# Altium schematic sheet SPI_UART.SchDoc
size C
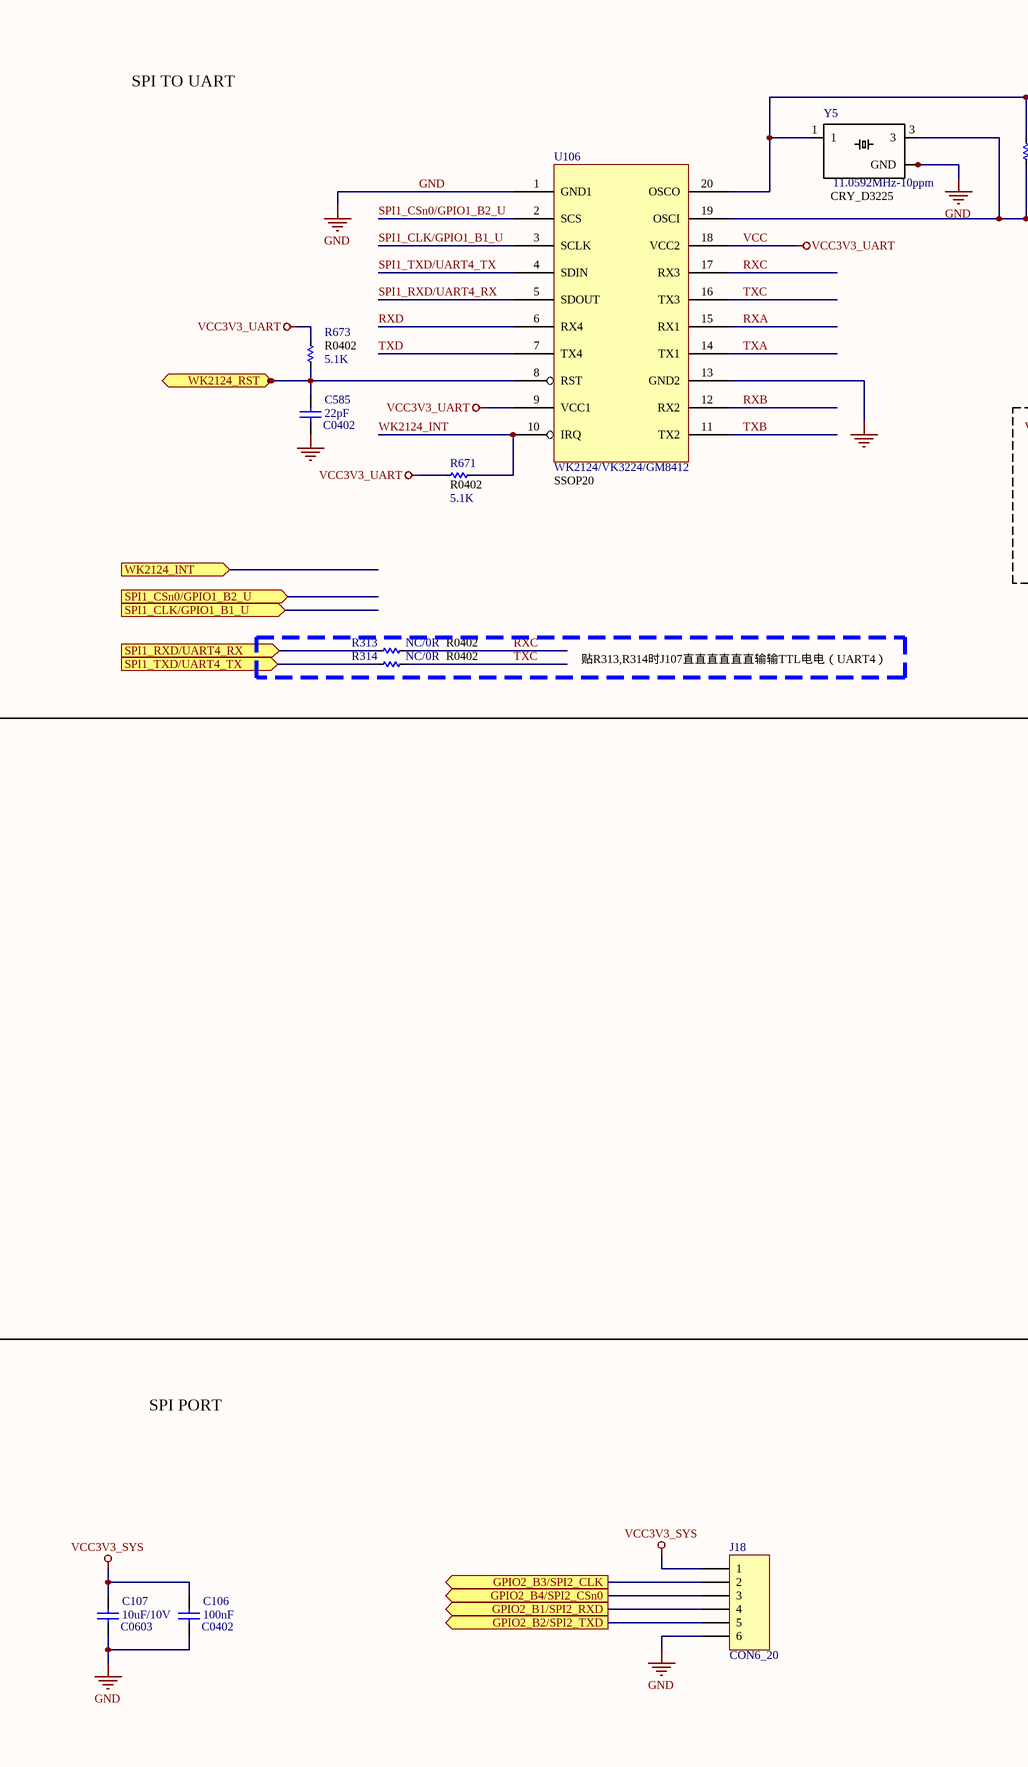
[diagram p0: SPI_UART.SchDoc, left]
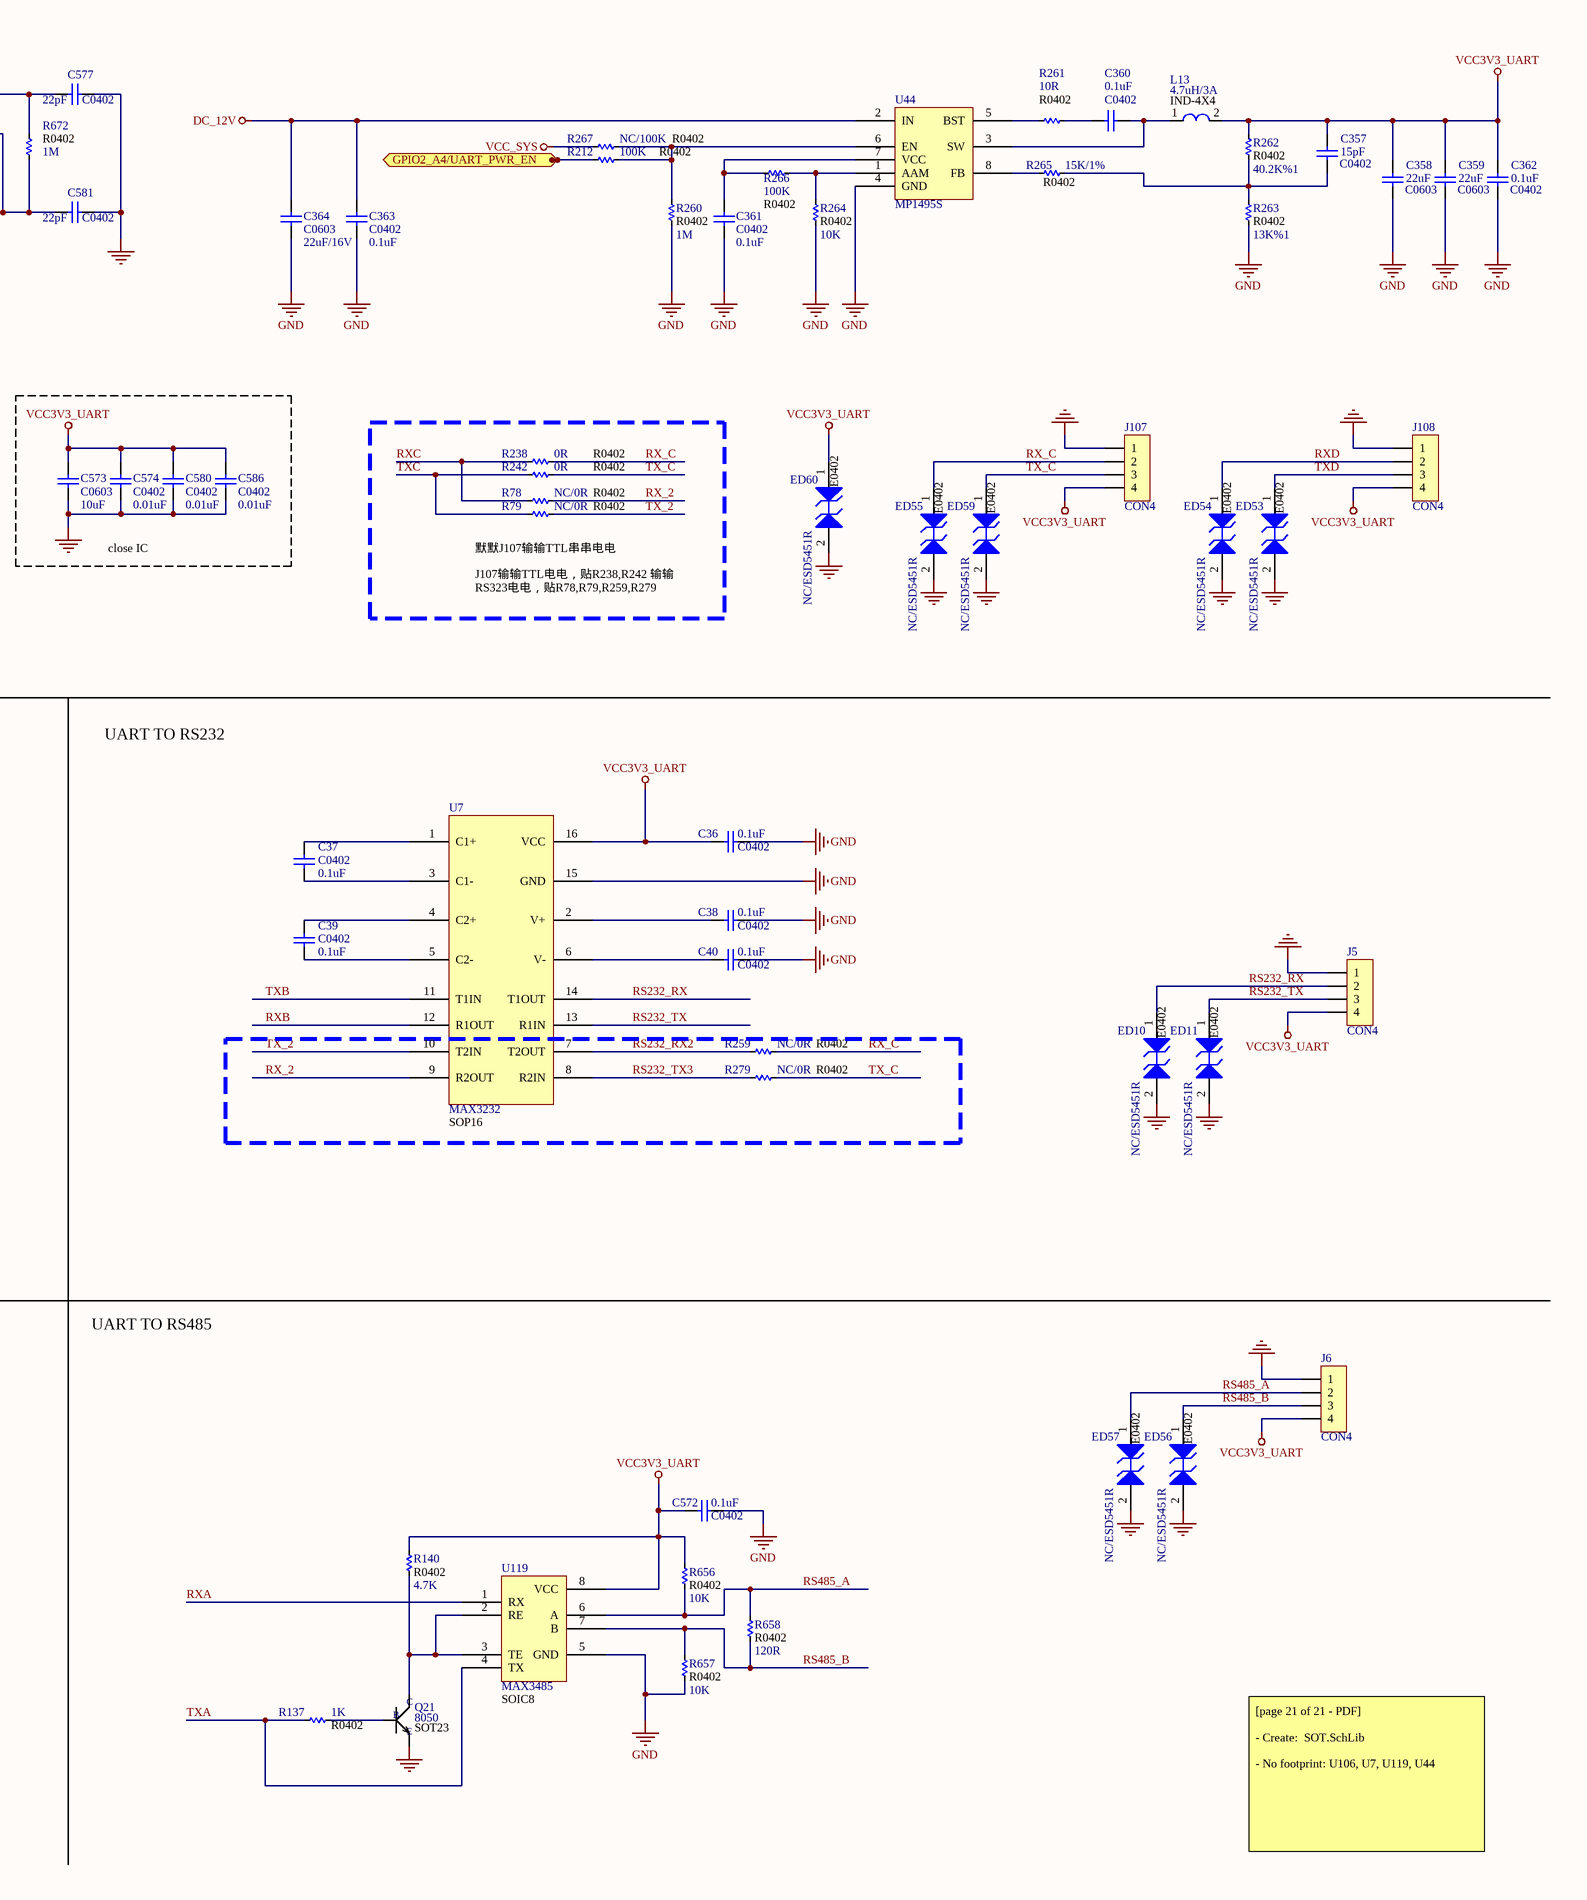
[diagram p1: SPI_UART.SchDoc, right]

## Parts
C36  C0402  value 0.1uF  [C 0402]
C37  C0402  value 0.1uF  [C 0402]
C38  C0402  value 0.1uF  [C 0402]
C39  C0402  value 0.1uF  [C 0402]
C40  C0402  value 0.1uF  [C 0402]
C106  C0402  value 100nF  [C 0402]
C107  C0603  value 10uF/10V  [C 0603]
C357  C0402  value 15pF  [C 0402]
C358  C0603  value 22uF  [C 0603]
C359  C0603  value 22uF  [C 0603]
C360  C0402  value 0.1uF  [C 0402]
C361  C0402  value 0.1uF  [C 0402]
C362  C0402  value 0.1uF  [C 0402]
C363  C0402  value 0.1uF  [C 0402]
C364  C0603  value 22uF/16V  [C 0603]
C572  C0402  value 0.1uF  [C 0402]
C573  C0603  value 10uF  [C 0603]
C574  C0402  value 0.01uF  [C 0402]
C577  C0402  value 22pF  [C 0402]
C580  C0402  value 0.01uF  [C 0402]
C581  C0402  value 22pF  [C 0402]
C585  C0402  value 22pF  [C 0402]
C586  C0402  value 0.01uF  [C 0402]
ED10  NC/ESD5451R  size: E0402  [DFN1006-2L]
ED11  NC/ESD5451R  size: E0402  [DFN1006-2L]
ED53  NC/ESD5451R  size: E0402  [DFN1006-2L]
ED54  NC/ESD5451R  size: E0402  [DFN1006-2L]
ED55  NC/ESD5451R  size: E0402  [DFN1006-2L]
ED56  NC/ESD5451R  size: E0402  [DFN1006-2L]
ED57  NC/ESD5451R  size: E0402  [DFN1006-2L]
ED59  NC/ESD5451R  size: E0402  [DFN1006-2L]
ED60  NC/ESD5451R  size: E0402  [DFN1006-2L]
J5  CON4  [CON4]
J6  CON4  [CON4]
J18  CON6_20  [Header6]
J107  CON4  [CON4]
J108  CON4  [CON4]
L13  4.7uH/3A  [L-SMD-M-7.3x4.5]
Q21  8050  [*SOT-23]
R78  R0402  value NC/0R  [R 0402]
R79  R0402  value NC/0R  [R 0402]
R137  R0402  value 1K  [R 0402]
R140  R0402  value 4.7K  [R 0402]
R212  R0402  value 100K  [R 0402]
R238  R0402  value 0R  [R 0402]
R242  R0402  value 0R  [R 0402]
R259  R0402  value NC/0R  [R 0402]
R260  R0402  value 1M  [R 0402]
R261  R0402  value 10R  [R 0402]
R262  R0402  value 40.2K%1  [R 0402]
R263  R0402  value 13K%1  [R 0402]
R264  R0402  value 10K  [R 0402]
R265  R0402  value 15K/1%  [R 0402]
R266  R0402  value 100K  [R 0402]
R267  R0402  value NC/100K  [R 0402]
R279  R0402  value NC/0R  [R 0402]
R313  R0402  value NC/0R  [R 0402]
R314  R0402  value NC/0R  [R 0402]
R656  R0402  value 10K  [R 0402]
R657  R0402  value 10K  [R 0402]
R658  R0402  value 120R  [R 0402]
R671  R0402  value 5.1K  [R 0402]
R672  R0402  value 1M  [R 0402]
R673  R0402  value 5.1K  [R 0402]
U7  MAX3232  Package: SOP16  [SOP-16]
U44  MP1495S  [TSOT-23-8]
U106  WK2124/VK3224/GM8412  [SOP-20]
U119  MAX3485  Package: SOIC8  [SOIC-8]
Y5  11.0592MHz-10ppm  [Crystal 4-SMD 32x25]

## Ports
GPIO2_A4/UART_PWR_EN (in), GPIO2_B1/SPI2_RXD (out), GPIO2_B2/SPI2_TXD (out), GPIO2_B3/SPI2_CLK (out), GPIO2_B4/SPI2_CSn0 (out), SPI1_CLK/GPIO1_B1_U (in), SPI1_CSn0/GPIO1_B2_U (in), SPI1_RXD/UART4_RX (in), SPI1_TXD/UART4_TX (in), WK2124_INT (in), WK2124_RST (in)

## Nets
DC_12V: C363.1 C364.1 U44.2(IN)
GND: C36.1 C38.1 C40.1 C106.1 C107.1 C358.1 C359.1 C361.2 C362.1 C363.2 C364.2 C572.1 C573.2 C574.2 C577.1 C580.2 C581.1 C585.1 C586.2 ED10.2(A2) ED11.2(A2) ED53.2(A2) ED54.2(A2) ED55.2(A2) ED56.2(A2) ED57.2(A2) ED59.2(A2) ED60.2(A2) J5.1 J6.1 J18.6 J107.1 J108.1 Q21.2(E) R260.2 R263.1 R264.2 R657.2 U7.15(GND) U44.4(GND) U106.1(GND1) U106.13(GND2) U119.5(GND) Y5.2(GND) Y5.4(GND)
VCC: C36.2 C357.2 C358.2 C359.2 C362.2 C572.2 C573.1 C574.1 C580.1 C586.1 ED60.1(A1) J5.4 J6.4 J107.4 J108.4 L13.2 R140.1 R262.2 R656.1 R671.2 R673.2 U7.16(VCC) U106.9(VCC1) U106.18(VCC2) U119.8(VCC)  [also labelled VCC3V3_UART]
VCC3V3_SYS: C106.2 C107.2 J18.1
VCC_SYS: R267.2
GPIO2_A4/UART_PWR_EN: R212.2 ; port GPIO2_A4/UART_PWR_EN
GPIO2_B1/SPI2_RXD: J18.4 ; port GPIO2_B1/SPI2_RXD
GPIO2_B2/SPI2_TXD: J18.5 ; port GPIO2_B2/SPI2_TXD
GPIO2_B3/SPI2_CLK: J18.2 ; port GPIO2_B3/SPI2_CLK
GPIO2_B4/SPI2_CSn0: J18.3 ; port GPIO2_B4/SPI2_CSn0
RS232_RX: ED10.1(A1) J5.2 U7.14(T1OUT)
RS232_RX2: R259.2 U7.7(T2OUT)
RS232_TX: ED11.1(A1) J5.3 U7.13(R1IN)
RS232_TX3: R279.2 U7.8(R2IN)
RS485_A: ED57.1(A1) J6.2 R656.2 R658.1 U119.6(A)
RS485_B: ED56.1(A1) J6.3 R657.1 R658.2 U119.7(B)
RX_2: R78.1 U7.9(R2OUT)
RX_C: ED55.1(A1) J107.2 R238.1 R259.1
RXA: U106.15(RX1) U119.1(RX)
RXB: U7.12(R1OUT) U106.12(RX2)
RXC: R78.2 R238.2 R313.1 U106.17(RX3)
RXD: ED54.1(A1) J108.2 U106.6(RX4)
SPI1_CLK/GPIO1_B1_U: U106.3(SCLK)
SPI1_CSn0/GPIO1_B2_U: U106.2(SCS)
SPI1_RXD/UART4_RX: U106.5(SDOUT)
SPI1_RXD/UART4_RX: R313.2 ; port SPI1_RXD/UART4_RX  [a separate net that carries the same name]
SPI1_TXD/UART4_TX: U106.4(SDIN)
SPI1_TXD/UART4_TX: R314.2 ; port SPI1_TXD/UART4_TX  [a separate net that carries the same name]
TX_2: R79.1 U7.10(T2IN)
TX_C: ED59.1(A1) J107.3 R242.1 R279.1
TXA: R137.2 U106.14(TX1) U119.4(TX)
TXB: U7.11(T1IN) U106.11(TX2)
TXC: R79.2 R242.2 R314.1 U106.16(TX3)
TXD: ED53.1(A1) J108.3 U106.7(TX4)
WK2124_INT: R671.1 U106.10(IRQ)
WK2124_RST: C585.2 R673.1 U106.8(RST) ; port WK2124_RST
NetC37_1: C37.1 U7.3(C1-)
NetC37_2: C37.2 U7.1(C1+)
NetC38_2: C38.2 U7.2(V+)
NetC39_1: C39.1 U7.5(C2-)
NetC39_2: C39.2 U7.4(C2+)
NetC40_2: C40.2 U7.6(V-)
NetC357_1: C357.1 R262.1 R263.2 R265.2
NetC360_1: C360.1 R261.2
NetC360_2: C360.2 L13.1 U44.3(SW)
NetC361_1: C361.1 R266.2 U44.7(VCC)
NetC577_2: C577.2 R672.2 U106.20(OSCO) Y5.1
NetC581_2: C581.2 R672.1 U106.19(OSCI) Y5.3
NetQ21_1: Q21.1(B) R137.1
NetQ21_3: Q21.3(C) R140.2 U119.2(RE) U119.3(TE)
NetR212_1: R212.1 R260.1 R267.1 U44.6(EN)
NetR261_1: R261.1 U44.5(BST)
NetR264_1: R264.1 R266.1 U44.1(AAM)
NetR265_1: R265.1 U44.8(FB)

## Notes on the sheet
- SPI TO UART
- close IC
- 默默J107输输TTL串串电电
  J107输输TTL电电，贴R238,R242 输输RS323电电，贴R78,R79,R259,R279
- 贴R313,R314时J107直直直直直直输输TTL电电（UART4）
- UART TO RS232
- UART TO RS485
- SPI PORT
- [page 21 of 21 - PDF]
  - Create:  SOT.SchLib
  - No footprint: U106, U7, U119, U44
- (in symbol ABM8-30.000MHZ-10-1-U-T) CRY_D3225
- (in symbol L-SMD-1) IND-4X4
- (in symbol SMD-TRANSISTORS-NPN-25V-500MW(SOT-23)) SOT23

## Library data of the parts
C36-C40 C106 C107 C357-C364 C572-C574 C577 C580 C581 C585 C586 = Cap: Capacitor; Published: 8-Jun-2000; LatestRevisionDate: 17-Jul-2002; LatestRevisionNote: Re-released for DXP Platform.; PackageReference: RAD-0.3; Publisher: Altium Limited; PackageDescription: Radial Cap, Thru-Hole; 2 Leads; 0.3 in Pin Spacing
ED10 ED11 ED53-ED57 ED59 ED60 = 1SMB54CAT3: 600 W Peak Power Zener Transient Voltage Suppressor, Bidirectional, 2-Pin SMB, Tape and Reel; Manufacturer: On Semiconductor; IR Max (uA): 5; PPK Max (W): 600; V(BR) Typ (V): 63.16; DatasheetVersion: Rev. A; PackageVersion: Rev. A, 01/2000; PackageReference: SMB-2-403C-01; PackageDescription: 2-Pin Small Molded Package, J-Bend Lead, Body 4.315 x 3.555 mm; Supplier 1: Digi-Key; Supplier Part Number 1: 1SMB54CAT3-ND; Direction: Bidirectional; Packing: Tape and Reel; Mounting Technology: Surface Mount; PartNumber: 1SMB54CAT3; ComponentLink1Description: Manufacturer URL; ComponentLink1URL: http://www.onsemi.com/; ComponentLink2Description: Datasheet; ComponentLink2URL: http://www.onsemi.com/pub_link/Collateral/1SMB10CAT3-D.PDF; ComponentLink3Description: Package Specification; ComponentLink3URL: http://www.onsemi.com/pub_link/Collateral/1SMB10CAT3-D.PDF
J5 J6 J107 J108 = JP4x1-2.0: WR-PHD 2.00 mm Socket Header; Manufacturer: W¨¹rth Elektronik eiSos GmbH; partNo: 62000411821; ComponentLink1 Description: Manufacturer; ComponentLink2 Description: Datasheet; NoPins: 04; Created Date: 2 April 2013; ComponentLink1URL: http://www.we-online.com; ComponentLink2URL: http://katalog.we-online.de/em/datasheet/6200xx11821.pdf; Created by: Karrer Zheng
J18 = Header 6: Header, 6-Pin; LatestRevisionDate: 17-Jul-2002; LatestRevisionNote: Re-released for DXP Platform.; Publisher: Altium Limited
L13 = L-SMD-1: partNo: 78477010; Manufacturer: Wurth Elektronik; Inductance: 1.0 μH; ComponentLink1Description: Manufacturer; ComponentLink1URL: http://www.we-online.de; Created by: Baojun Chen; Created Date: Nov.2015; ComponentLink2Description: Datasheet; ComponentLink2URL: http://katalog.we-online.de/pbs/datasheet/78477010.pdf
Q21 = SMD-TRANSISTORS-NPN-25V-500MW(SOT-23): MF: Recom Power; MP: S8050; Package: SMD-8 Samsung; Price: None; SnapEDA_Link: https://www.snapeda.com/parts/S8050/Recom%20Power/view-part/?ref=snap; Availability: Unavailable; Value: *
R78 R79 R137 R140 R212 R238 R242 R259-R267 R279 R313 R314 R656-R658 R671-R673 = Res-SMD: Resistor; Manufacturer: Generic Components; Class: Passive; Published: 08/06/2000; Publisher: Altium Hobart Technology Centre
U106 = SSOP20: Package: SSOP20
Y5 = ABM8-30.000MHZ-10-1-U-T: Ultra Miniature Crystal, SMD Ceramic, 30.000MHZ, 10pF, 10ppm@25C, 10ppm -10+60C,; MF: Abracon; SnapEDA_Link: https://www.snapeda.com/parts/ABM8-30.000MHZ-10-1-U-T/Abracon%20LLC/view-part/?ref=snap; MP: ABM8-30.000MHZ-10-1-U-T; Availability: Unavailable; Price: None; Package: SMD-4 Abracon; Value: *